# EAGLE design VFD PSU (EAGLE 9.1.3)
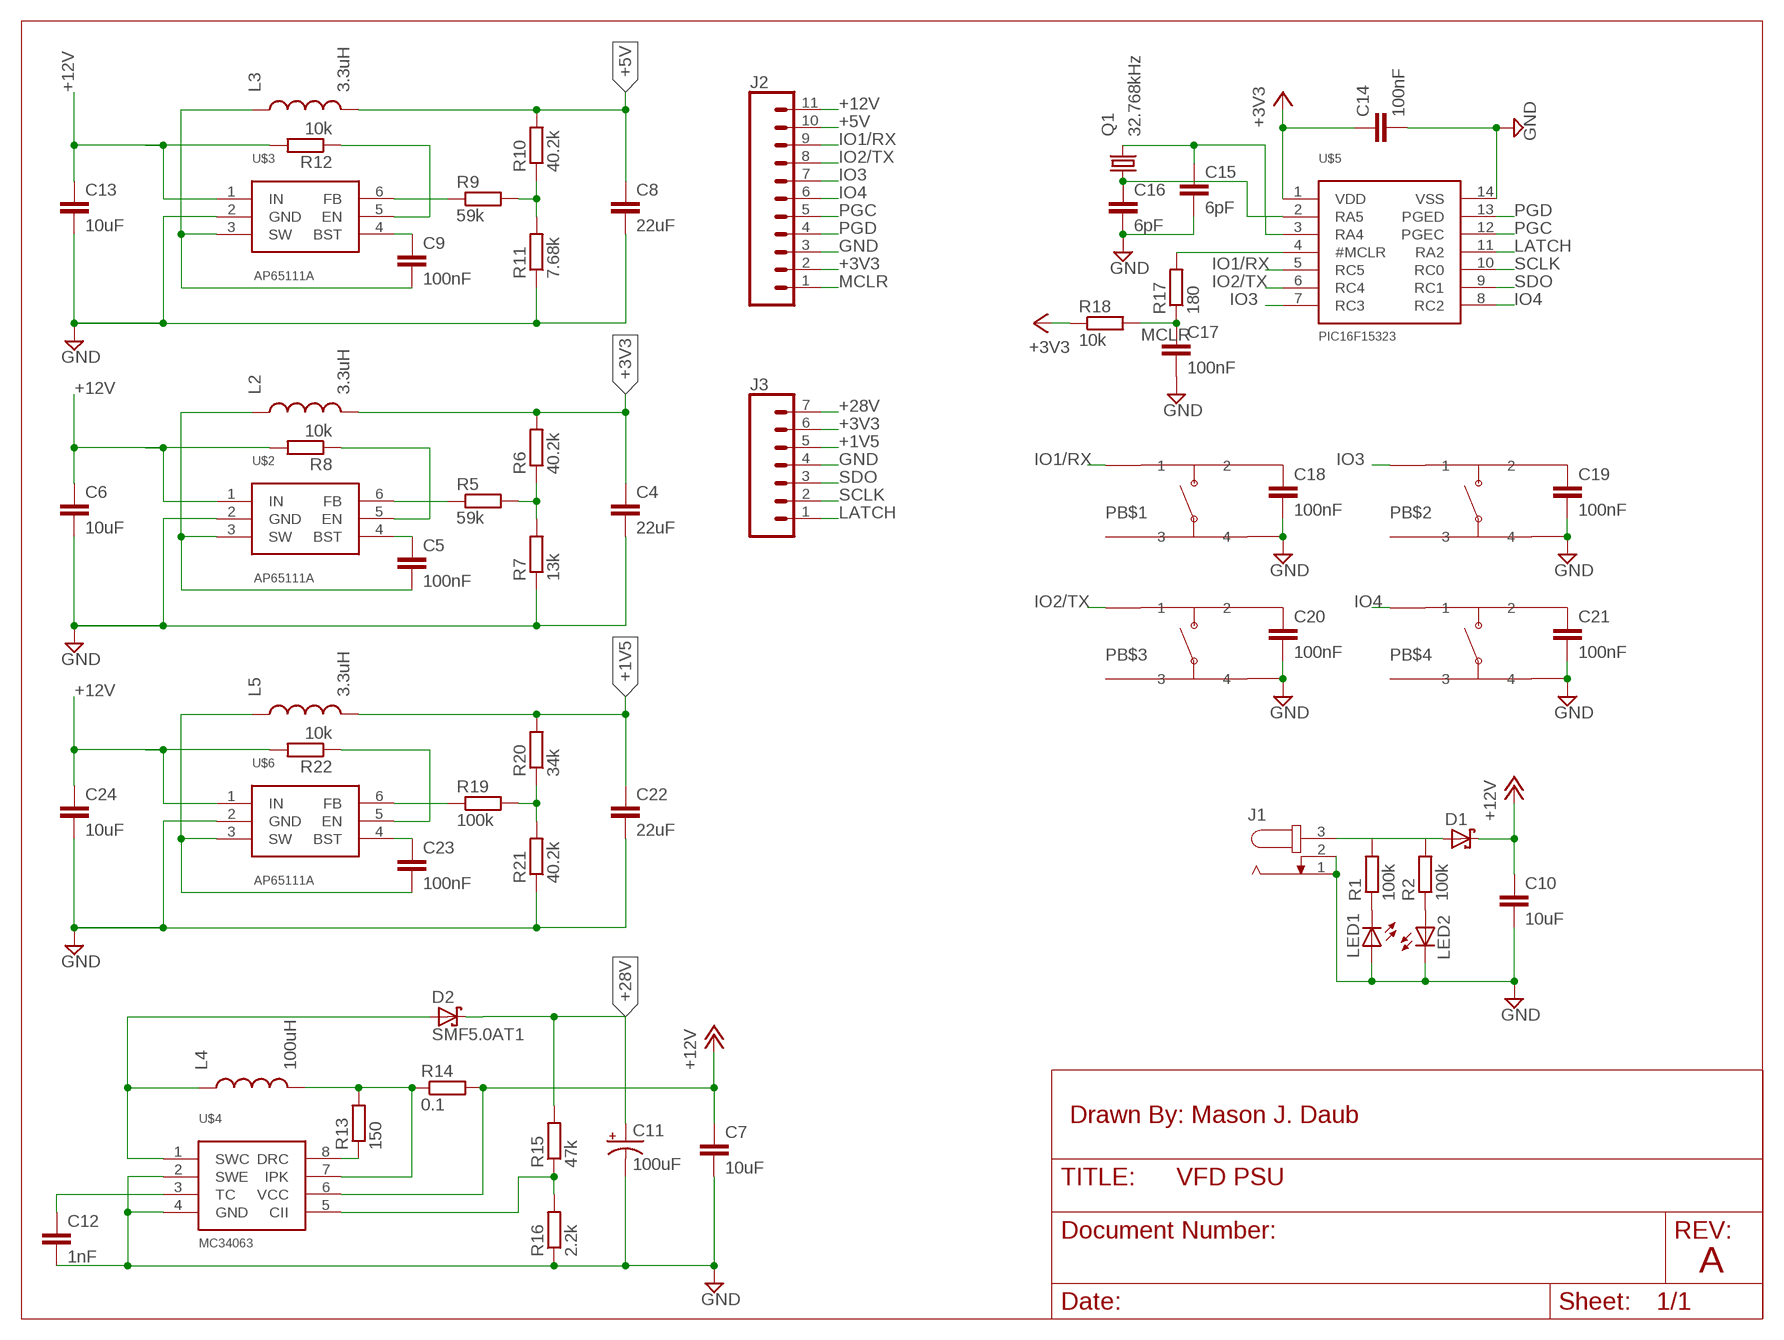
[diagram p0: schematic, sheet 1]

## Parts
C4  22uF  C-EUC0805  [C0805]
C5  100nF  C-EUC0603  [C0603]
C6  10uF  C-EUC0805  [C0805]
C7  10uF  C-EUC0805  [C0805]
C8  22uF  C-EUC0805  [C0805]
C9  100nF  C-EUC0603  [C0603]
C10  10uF  C-EUC0805  [C0805]
C11  100uF  22UF-POLAR-PANASONIC_C-35V-20%  [PANASONIC_C]
C12  1nF  C-EUC0603  [C0603]
C13  10uF  C-EUC0805  [C0805]
C14  100nF  C-EUC0603  [C0603]
C15  6pF  C-EUC0603  [C0603]
C16  6pF  C-EUC0603  [C0603]
C17  100nF  C-EUC0603  [C0603]
C18  100nF  C-EUC0603  [C0603]
C19  100nF  C-EUC0603  [C0603]
C20  100nF  C-EUC0603  [C0603]
C21  100nF  C-EUC0603  [C0603]
C22  22uF  C-EUC0805  [C0805]
C23  100nF  C-EUC0603  [C0603]
C24  10uF  C-EUC0805  [C0805]
D1  SCHOTTKY-DIODESMD  [SMB]
D2  SMF5.0AT1  [SOD123FL]
J1  JACK-PLUG0  [SPC4077]
J2  CONN_111X11_NO_SILK  [1X11_NO_SILK]
J3  CONN_07LONGPADS  [1X07_LONGPADS]
L2  3.3uH  L1008  [1008]
L3  3.3uH  L1008  [1008]
L4  100uH  ETQ-P5M101YGK  [2-SMD]
L5  3.3uH  L1008  [1008]
LED1  LEDSMT1206  [1206]
LED2  LEDSMT1206  [1206]
PB$1  PTS645SM43SMTR92-LFS  [SMDTACTILE]
PB$2  PTS645SM43SMTR92-LFS  [SMDTACTILE]
PB$3  PTS645SM43SMTR92-LFS  [SMDTACTILE]
PB$4  PTS645SM43SMTR92-LFS  [SMDTACTILE]
Q1  32.768kHz  KX-327-S  [8.2X3.8]
R1  100k  R-EU_R0603  [R0603]
R2  100k  R-EU_R0603  [R0603]
R5  59k  R-EU_R0603  [R0603]
R6  40.2k  R-EU_R0603  [R0603]
R7  13k  R-EU_R0603  [R0603]
R8  10k  R-EU_R0603  [R0603]
R9  59k  R-EU_R0603  [R0603]
R10  40.2k  R-EU_R0603  [R0603]
R11  7.68k  R-EU_R0603  [R0603]
R12  10k  R-EU_R0603  [R0603]
R13  150  R-EU_R0603  [R0603]
R14  0.1  R-EU_R0805  [R0805]
R15  47k  R-EU_R0603  [R0603]
R16  2.2k  R-EU_R0603  [R0603]
R17  180  R-EU_R0603  [R0603]
R18  10k  R-EU_R0603  [R0603]
R19  100k  R-EU_R0603  [R0603]
R20  34k  R-EU_R0603  [R0603]
R21  40.2k  R-EU_R0603  [R0603]
R22  10k  R-EU_R0603  [R0603]
U$2  AP65111A  [TSOT23-6]
U$3  AP65111A  [TSOT23-6]
U$4  MC34063  [SO08]
U$5  PIC16F15323  [SO14]
U$6  AP65111A  [TSOT23-6]

## Nets
+1V5: C22.1 J3.5 L5.P$2 R20.2
+3V3: C4.1 C14.1 J2.2 J3.6 L2.P$2 R6.2 R18.1 U$5.1(VDD)
+5V: C8.1 J2.10 L3.P$2 R10.2
+12V: C6.1 C7.1 C10.1 C13.1 C24.1 D1.C J2.11 R8.2 R12.2 R14.2 R22.2 U$2.1(IN) U$3.1(IN) U$4.6(VCC) U$6.1(IN)
+28V: C11.+ D2.C J3.7 R15.2
GND: C4.2 C6.2 C7.2 C8.2 C10.2 C11.- C12.2 C13.2 C14.2 C15.2 C16.2 C17.2 C18.2 C19.2 C20.2 C21.2 C22.2 C24.2 J1.1 J1.2 J2.3 J3.4 LED1.A LED2.C PB$1.P$4 PB$2.P$4 PB$3.P$4 PB$4.P$4 R7.1 R11.1 R16.1 R21.1 U$2.2(GND) U$3.2(GND) U$4.2(SWE) U$4.4(GND) U$5.14(VSS) U$6.2(GND)
IO1/RX: J2.9 PB$1.P$1 U$5.5(RC5)
IO2/TX: J2.8 PB$3.P$1 U$5.6(RC4)
IO3: J2.7 PB$2.P$1 U$5.7(RC3)
IO4: J2.6 PB$4.P$1 U$5.8(RC2)
LATCH: J3.1 U$5.11(RA2)
MCLR: C17.1 J2.1 R17.1 R18.2
N$1: R15.1 R16.2 U$4.5(CII)
N$2: D1.A J1.3 R1.2 R2.2
N$3: LED2.A R2.1
N$4: L4.P$2 R13.2 R14.1 U$4.7(IPK)
N$5: LED1.C R1.1
N$8: R8.1 U$2.5(EN)
N$9: C5.2 L2.P$1 U$2.3(SW)
N$10: C5.1 U$2.4(BST)
N$11: R5.1 U$2.6(FB)
N$12: R5.2 R6.1 R7.2
N$13: R13.1 U$4.8(DRC)
N$14: R12.1 U$3.5(EN)
N$15: C9.2 L3.P$1 U$3.3(SW)
N$16: C9.1 U$3.4(BST)
N$17: R9.1 U$3.6(FB)
N$18: R9.2 R10.1 R11.2
N$19: D2.A L4.P$1 U$4.1(SWC)
N$21: C15.1 Q1.4 U$5.3(RA4)
N$22: C16.1 Q1.1 U$5.2(RA5)
N$23: C12.1 U$4.3(TC)
N$24: R17.2 U$5.4(#MCLR)
N$25: C18.1 PB$1.P$2
N$26: R22.1 U$6.5(EN)
N$27: C19.1 PB$2.P$2
N$28: C23.2 L5.P$1 U$6.3(SW)
N$29: C20.1 PB$3.P$2
N$30: C23.1 U$6.4(BST)
N$31: C21.1 PB$4.P$2
N$32: R19.1 U$6.6(FB)
N$33: R19.2 R20.1 R21.2
PGC: J2.5 U$5.12(PGEC)
PGD: J2.4 U$5.13(PGED)
SCLK: J3.2 U$5.10(RC0)
SDO: J3.3 U$5.9(RC1)
Unconnected: PB$1.P$3 PB$2.P$3 PB$3.P$3 PB$4.P$3

## Notes on the sheet
- Drawn By: Mason J. Daub
- A

## Library data of the parts
C4-C10 C12-C24 = rcl:C-EU: CAPACITOR, European symbol; SPICEPREFIX: C
C11 = SparkFun-Capacitors:22UF-POLAR: 22µF polarized capacitors A capacitor is a passive two-terminal electrical component used to store electrical energy temporarily in an electric field.; PROD_ID: CAP-08618; VALUE: 22uF
D1 = diode:SCHOTTKY-DIODE: Schottky Diode
D2 = diode:SMF5.0AT1: 200 W Transient Voltage Suppressor Source: Data sheet <http://www.onsemi.com/pub_link/Collateral/SMF5.0AT1-D.PDF>
J1 = con-jack:JACK-PLUG: DC POWER JACK Power Jack, DC, Right Angle, Through Hole, Rated 5A at 16VDC, PC Terminals Distributor: Farnell (www.Farnell.de) Drawing: 84N1161.pdf / 84N1162.pdf Manufacturer: SPC Technology (www.spctechnology.com) Type: SPC4077 / SPC 4078; OC_FARNELL: unknown; OC_NEWARK: unknown
J2 = SparkFun-Connectors:CONN_11: Multi connection point. Often used as Generic Header-pin footprint for 0.1 inch spaced/style header connections On any of the 0.1 inch spaced packages, you can populate with these: Break Away Headers - Straight <https://www.sparkfun.com/products/116> (PRT-00116) Break Away Male Headers - Right Angle <https://www.sparkfun.com/products/553> (PRT-00553) Female Headers <https://www.sparkfun.com/products/115> (PRT-00115) Break Away Headers - Machine Pin <https://www.sparkfun.com/products/117> (PRT-00117) Break Away Female Headers - Swiss Machine Pin <https://www.sparkfun.com/products/743> (PRT-00743) For SCREWTERMINALS and SPRING TERMINALS visit here: Screw Terimnals on SparkFun.com <https://www.sparkfun.com/search/results?term=Screw+Terminals> (5mm/3.5mm/2.54mm spacing) This device is also useful as a general connection point to wire up your design to another part of your project. Our various solder wires solder well into these plated through hole pads. Hook-Up Wire - Assortment (Stranded, 22 AWG) <https://www.sparkfun.com/products/11375> (PRT-11375) Hook-Up Wire - Assortment (Solid Core, 22 AWG) <https://www.sparkfun.com/products/11367> (PRT-11367) View the entire wire category on our website here <https://www.sparkfun.com/categories/141>
J3 = SparkFun-Connectors:CONN_07: Multi connection point. Often used as Generic Header-pin footprint for 0.1 inch spaced/style header connections On any of the 0.1 inch spaced packages, you can populate with these: Break Away Headers - Straight <https://www.sparkfun.com/products/116> (PRT-00116) Break Away Male Headers - Right Angle <https://www.sparkfun.com/products/553> (PRT-00553) Female Headers <https://www.sparkfun.com/products/115> (PRT-00115) Break Away Headers - Machine Pin <https://www.sparkfun.com/products/117> (PRT-00117) Break Away Female Headers - Swiss Machine Pin <https://www.sparkfun.com/products/743> (PRT-00743) For SCREWTERMINALS and SPRING TERMINALS visit here: Screw Terimnals on SparkFun.com <https://www.sparkfun.com/search/results?term=Screw+Terminals> (5mm/3.5mm/2.54mm spacing) This device is also useful as a general connection point to wire up your design to another part of your project. Our various solder wires solder well into these plated through hole pads. Hook-Up Wire - Assortment (Stranded, 22 AWG) <https://www.sparkfun.com/products/11375> (PRT-11375) Hook-Up Wire - Assortment (Solid Core, 22 AWG) <https://www.sparkfun.com/products/11367> (PRT-11367) View the entire wire category on our website here <https://www.sparkfun.com/categories/141> Special notes: Molex polarized connector foot print use with SKU : PRT-08231 with associated crimp pins and housings. 1MM SMD Version SKU: PRT-10208 NOTES ON THE VARIANTS LOCK and LOCK_LONGPADS... This footprint was designed to help hold the alignment of a through-hole component (i.e. 6-pin header) while soldering it into place. You may notice that each hole has been shifted either up or down by 0.005 of an inch from it's more standard position (which is a perfectly straight line). This slight alteration caused the pins (the squares in the middle) to touch the edges of the holes. Because they are alternating, it causes a "brace" to hold the component in place. 0.005 has proven to be the perfect amount of "off-center" position when using our standard breakaway headers. Although looks a little odd when you look at the bare footprint, once you have a header in there, the alteration is very hard to notice. Also,if you push a header all the way into place, it is covered up entirely on the bottom side.
L2 L3 L5 = Mason-Passives:L1008
L4 = Mason-Passives:ETQ-P5M101YGK: 100uH j-lead surface mount inductor manufactured by panasonic
LED1 LED2 = led:LED: LED OSRAM: - CHIPLED LG R971, LG N971, LY N971, LG Q971, LY Q971, LO R971, LY R971 LH N974, LH R974 LS Q976, LO Q976, LY Q976 LO Q996 - Hyper CHIPLED LW Q18S LB Q993, LB Q99A, LB R99A - SideLED LS A670, LO A670, LY A670, LG A670, LP A670 LB A673, LV A673, LT A673, LW A673 LH A674 LY A675 LS A676, LA A676, LO A676, LY A676, LW A676 LS A679, LY A679, LG A679 - Hyper Micro SIDELED® LS Y876, LA Y876, LO Y876, LY Y876 LT Y87S - SmartLED LW L88C, LW L88S LB L89C, LB L89S, LG L890 LS L89K, LO L89K, LY L89K LS L896, LA L896, LO L896, LY L896 - TOPLED LS T670, LO T670, LY T670, LG T670, LP T670 LSG T670, LSP T670, LSY T670, LOP T670, LYG T670 LG T671, LOG T671, LSG T671 LB T673, LV T673, LT T673, LW T673 LH T674 LS T676, LA T676, LO T676, LY T676, LB T676, LH T676, LSB T676, LW T676 LB T67C, LV T67C, LT T67C, LS T67K, LO T67K, LY T67K, LW E67C LS E67B, LA E67B, LO E67B, LY E67B, LB E67C, LV E67C, LT E67C LW T67C LS T679, LY T679, LG T679 LS T770, LO T770, LY T770, LG T770, LP T770 LB T773, LV T773, LT T773, LW T773 LH T774 LS E675, LA E675, LY E675, LS T675 LS T776, LA T776, LO T776, LY T776, LB T776 LHGB T686 LT T68C, LB T68C - Hyper Mini TOPLED® LB M676 - Mini TOPLED Santana® LG M470 LS M47K, LO M47K, LY M47K Source: http://www.osram.convergy.de LUXEON: - LUMILED® LXK2-PW12-R00, LXK2-PW12-S00, LXK2-PW14-U00, LXK2-PW14-V00 LXK2-PM12-R00, LXK2-PM12-S00, LXK2-PM14-U00 LXK2-PE12-Q00, LXK2-PE12-R00, LXK2-PE12-S00, LXK2-PE14-T00, LXK2-PE14-U00 LXK2-PB12-K00, LXK2-PB12-L00, LXK2-PB12-M00, LXK2-PB14-N00, LXK2-PB14-P00, LXK2-PB14-Q00 LXK2-PR12-L00, LXK2-PR12-M00, LXK2-PR14-Q00, LXK2-PR14-R00 LXK2-PD12-Q00, LXK2-PD12-R00, LXK2-PD12-S00 LXK2-PH12-R00, LXK2-PH12-S00 LXK2-PL12-P00, LXK2-PL12-Q00, LXK2-PL12-R00 Source: www.luxeon.com KINGBRIGHT: KA-3528ASYC Source: www.kingbright.com
PB$1-PB$4 = Mason-Misc:PTS645SM43SMTR92-LFS: Standard tactile switch
Q1 = crystal-geyer_V1_0:KX-327: Tuning Fork Crystals (kHz) SMD: KX327 - Serie Model Size l/w/h [mm] Frequency Range Frequency Stability Temp. Range [°C] Load Capacitance AECQ 200 availabel Datasheet KX-327VT KX-327FT KX-327RT KX-327NHT KX-327NHF KX-327L KX-327S 1.25/1.05/0.5 1.6/1.0/0.5 2.0/1.2/0.6 3.2/1.5/0.8 3.2/1.5/0.8 7.0/1.5/1.4 8.2/3.8/2.5 32,768 kHz 32,768 kHz 32,768 kHz 32,768 kHz 32,768 kHz 32,768 kHz 32,768 kHz ±10 … ±20ppm ±10 … ±20ppm ±10 … ±20ppm ±10 … ±20ppm ±10 … ±20ppm ±10 … ±20ppm ±5 … ±20ppm (*) -40°C …+85°C (*) -40°C …+85°C (*) -40°C …+85°C (*) -40°C …+85°C (*) -40°C …+125°C (*) -40°C …+85°C (*) -40°C …+85°C 7/9/12,5 7/9/12,5 7/9/12,6 7/9/12,5 9/12,5 7/9/12,5 6/12,5 - - - - yes - - KX-327VT.pdf <http://www.geyer-electronic.de/uploads/tx_userartikelfrequenz/GEYER-KX-327VT.pdf> KX-327FT.pdf <http://www.geyer-electronic.de/uploads/tx_userartikelfrequenz/GEYER-KX-327FT.pdf> KX-327RT.pdf <http://www.geyer-electronic.de/uploads/tx_userartikelfrequenz/GEYER-KX-327RT.pdf> KX-327NHT.pdf <http://www.geyer-electronic.de/uploads/tx_userartikelfrequenz/GEYER-KX-327NHT.pdf> KX-327NHF.pdf <http://www.geyer-electronic.de/uploads/tx_userartikelfrequenz/GEYER-KX-327NHF.pdf> KX-327L.pdf <http://www.geyer-electronic.de/uploads/tx_userartikelfrequenz/GEYER-KX-327L.pdf> KX-327S.pdf <http://www.geyer-electronic.de/uploads/tx_userartikelfrequenz/GEYER-KX-327S.pdf> <http://www.geyer-electronic.de/fileadmin/template/img/logo-geyer-electronic.png> Details see: http://www.geyer-electronic.de/Frequenz-Produkte.9.0.html Created 2016-06-07, Hans Locher 2016 (C) Geyer Quartz Technology KX327VT,KX327FT,KX327RT,KX327NHT,KX327NHF,KX327S,KX327L;125105;1610;2012;3215;7015;8238;1,25x1,05,1.25x1.05;1,6x1,0,1.6x1.0;2,0x1,2,2.0x1.2;3,2x1,5,3.2x1.5;8,2x3,8,8.2x3.8,7.0x1.5,7,0x1,532.768kHz
R1 R2 R5-R13 R15-R22 = resistor:R-EU_: RESISTOR, European symbol
R14 = rcl:R-EU_: RESISTOR, European symbol; SPICEPREFIX: R
U$2 U$3 U$6 = Mason-Power:AP65111A: 18v 1.5A max buck converter manufactured by Diodes Incorporated
U$4 = Mason-Power:MC34063
U$5 = Mason-MCUs:PIC16F15323: A 14 pin 8 bit pic microcontroller manufactured by microchip

## Board
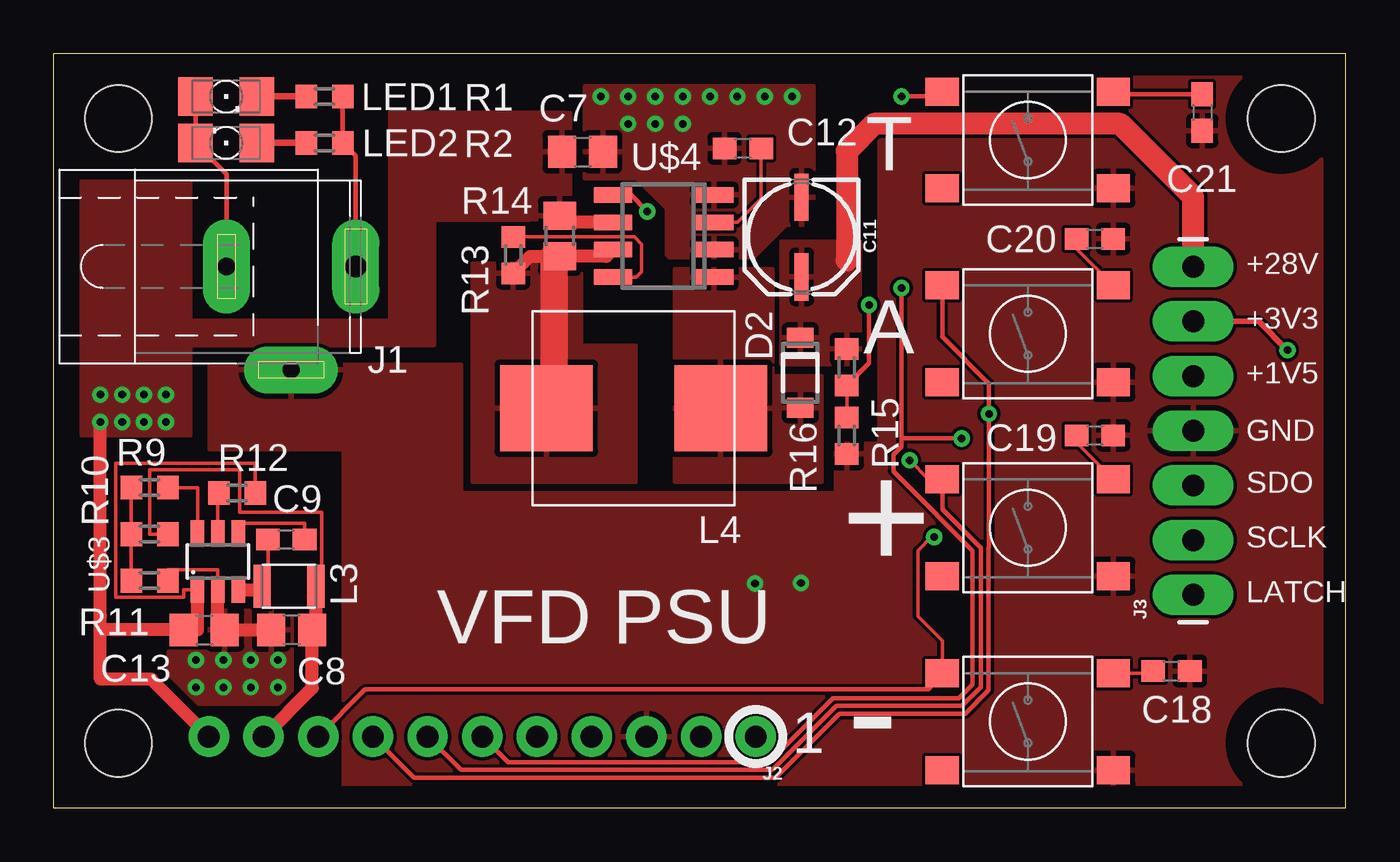
[diagram p1: board, top side]
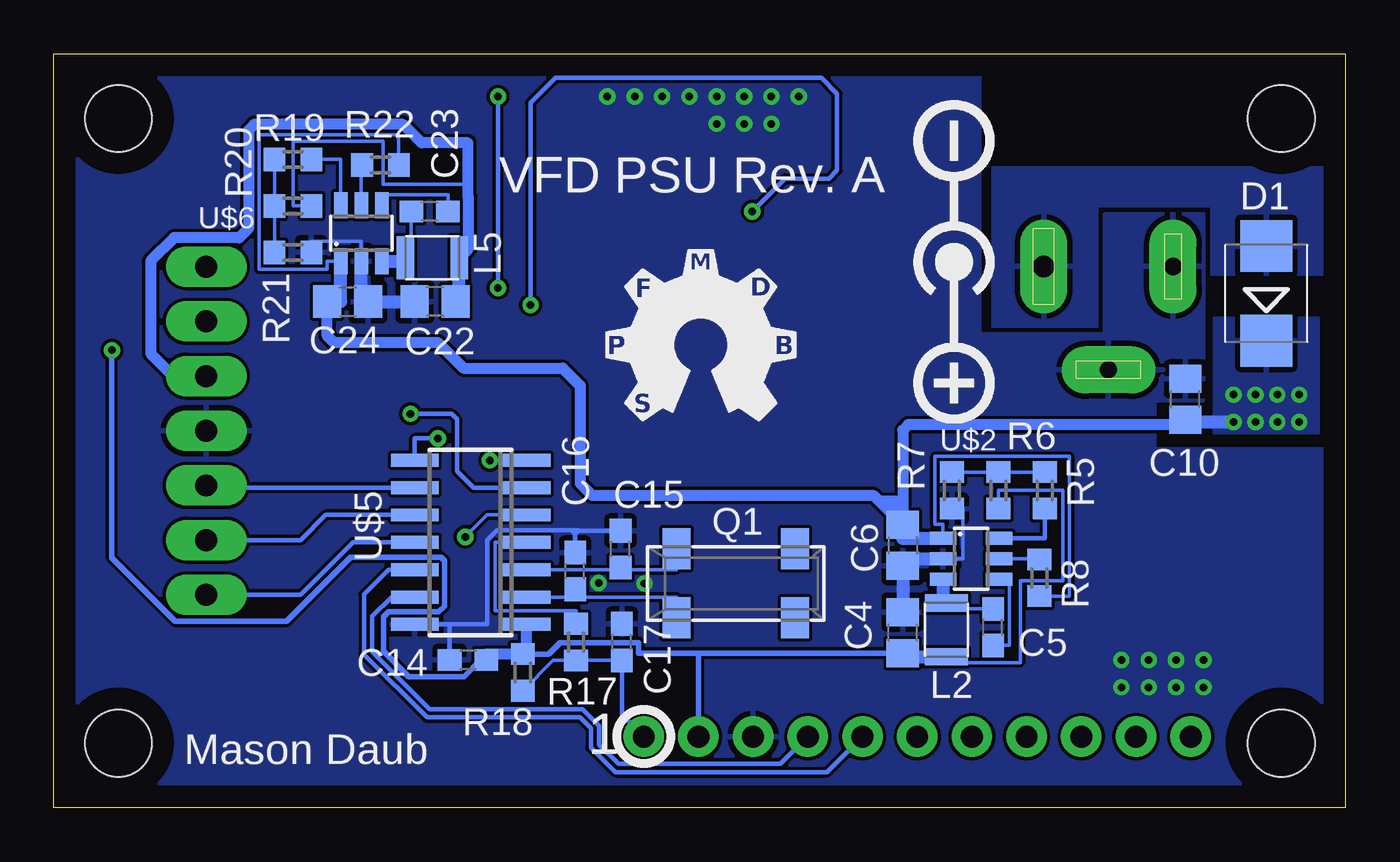
[diagram p2: board, bottom side, seen from below]

Size 60 x 35 mm. Coordinates in mm from the lower left corner, seen from the top.
Outline: 60,0 60,35 0,35 0,0 60,0
Copper layers (1*16): Top 0.035mm / dielectric 1.5mm / Bottom 0.035mm
Design rules "default": minimum track width 6mil, minimum drill 0.35mm, track to track 6mil, track to pad 6mil, pad to pad 6mil, via to via 6mil, smd to smd 6mil, copper to edge 40mil, drill to drill 6mil, minimum pad ring 10mil, minimum via ring 8mil, stop-mask expansion 4mil, vias tented up to drill 0mil, thermal gap 10mil
Holes 3.1 mm at 3,32 57,32 57,3 3,3

### Footprints (pad centres in the part's own frame; a part is rotated, then mirrored left to right if it is on the bottom)
C0805 = smd 1.3 x 1.5: 1 -0.95,0; 2 0.95,0
C0603 = smd 1.1 x 1: 1 -0.85,0; 2 0.85,0
PANASONIC_C = smd 2.2 x 0.65: + 1.9,-0.2; - -1.8,-0.2
SMB = smd 2.4 x 2.4: A 2.2,0; C -2.2,0
SOD123FL = smd 0.91 x 1.22: A 1.625,0; C -1.625,0
SPC4077 = drill 0.8 pad 2.184 long: 1 -3,0; 2 0,-4.8 | drill 1 pad 2.184 long: 3 3,0
1X11_NO_SILK = drill 1.016 pad 1.88: 1 0,0; 2 2.54,0; 3 5.08,0; 4 7.62,0; 5 10.16,0; 6 12.7,0; 7 15.24,0; 8 17.78,0; 9 20.32,0; 10 22.86,0; 11 25.4,0
1X07_LONGPADS = drill 1.016 pad 1.88 long: 1 0,0; 2 2.54,0; 3 5.08,0; 4 7.62,0; 5 10.16,0; 6 12.7,0; 7 15.24,0
1008 = smd 0.8 x 2: P$1 -1.25,0; P$2 1.25,0
2-SMD = smd 4.3 x 4: P$1 -4.05,0; P$2 4.05,0
1206 = smd 1.6 x 1.803: A -1.422,0; C 1.422,0
SMDTACTILE = smd 1.55 x 1.3: P$1 -3.975,2.25; P$2 3.975,2.25; P$3 -3.975,-2.25; P$4 3.975,-2.25
8.2X3.8 = smd 1.3 x 1.9: 1 -2.75,-1.6; 2 2.75,-1.6; 3 2.75,1.6; 4 -2.75,1.6
R0603 = smd 1 x 1.1: 1 -0.85,0; 2 0.85,0
R0805 = smd 1.3 x 1.5: 1 -0.95,0; 2 0.95,0
TSOT23-6 = smd 0.62 x 1.22: 1 -0.95,-1.3; 2 0,-1.3; 3 0.95,-1.3; 4 0.95,1.3; 5 0,1.3; 6 -0.95,1.3
SO08 = smd 0.72 x 1.78: 1 -1.905,-2.35; 2 -0.635,-2.35; 3 0.635,-2.35; 4 1.905,-2.35; 5 1.905,2.35; 6 0.635,2.35; 7 -0.635,2.35; 8 -1.905,2.35
SO14 = smd 0.6 x 2.2: 1 -3.81,-2.6; 2 -2.54,-2.6; 3 -1.27,-2.6; 4 0,-2.6; 5 1.27,-2.6; 6 2.54,-2.6; 7 3.81,-2.6; 8 3.81,2.6; 9 2.54,2.6; 10 1.27,2.6; 11 0,2.6; 12 -1.27,2.6; 13 -2.54,2.6; 14 -3.81,2.6

### Placement (x,y rotation side)
C4  20.57,8.13 90 bottom
C5  16.38,8.38 90 bottom
C6  20.57,12.19 270 bottom
C7  24.55,30.45 0 top
C8  11.05,8.26 180 top
C9  10.79,12.45 180 top
C10  7.45,18.96 90 bottom
C11  34.92,26.54 270 top
C12  32,30.61 180 top
C13  6.99,8.26 0 top
C14  40.77,6.86 180 bottom
C15  33.68,12.01 90 bottom
C16  35.79,10.99 90 bottom
C17  33.62,7.69 90 bottom
C18  51.91,6.35 0 top
C19  48.35,17.29 0 top
C20  48.35,26.41 0 top
C21  53.34,32.28 270 top
C22  42.29,23.5 180 bottom
C23  42.55,27.69 180 bottom
C24  46.35,23.5 0 bottom
D1  3.68,23.88 90 bottom
D2  34.67,20.19 270 top
J1  11.02,25.13 0 top
J2  32.6,3.3 180 top
J3  52.92,9.88 90 top
L2  18.54,8.26 270 bottom
L3  10.92,10.29 0 top
L4  26.92,18.54 180 top
L5  42.42,25.53 0 bottom
LED1  8,33.02 0 top
LED2  8,30.86 180 top
PB$1  45.23,4 0 top
PB$2  45.23,13 0 top
PB$3  45.23,22 0 top
PB$4  45.23,31 0 top
Q1  28.32,10.41 0 bottom
R1  12.57,33.02 0 top
R2  12.57,30.86 0 top
R5  13.97,14.73 90 bottom
R6  16.13,14.73 270 bottom
R7  18.29,14.73 90 bottom
R8  14.22,10.67 270 bottom
R9  4.45,14.86 180 top
R10  4.45,12.7 0 top
R11  4.45,10.54 180 top
R12  8.51,14.61 0 top
R13  21.34,25.65 270 top
R14  23.5,26.54 90 top
R15  36.83,20.45 90 top
R16  36.83,17.27 90 top
R17  35.74,7.69 90 bottom
R18  38.22,6.28 270 bottom
R19  48.9,30.1 180 bottom
R20  48.9,27.94 0 bottom
R21  48.9,25.78 180 bottom
R22  44.83,29.84 0 bottom
U$2  17.4,11.56 270 bottom
U$3  7.62,11.43 0 top
U$4  28.32,26.54 90 top
U$5  40.64,12.32 90 bottom
U$6  45.72,26.67 0 bottom

### Tracks (layer width: path | path; a pad name or v marks a point on that pad's centre or on a via)
+1V5
  Bottom 0.152: R20.2 48.26,27.94 | 48.26,27.94 48.9,27.94 | 48.26,27.94 48.9,27.94 | 48.9,27.94 48.9,30.94 44.7,30.94 44.7,30.62 44.71,30.62 44.71,29.07 44.7,29.07 44.7,28.96 40.89,28.96 40.89,26.04 41.17,26.04 L5.P$2
  Bottom 0.508: L5.P$2 40.74,25.96 40.74,28.35 40.77,28.38 40.77,30.86 42.92,30.86 43.78,31.73 50.7,31.73 50.7,31.7 50.96,31.44 50.96,26.89 51.4,26.45 51.42,26.47 54.42,26.47 55.5,25.39 55.5,21.08 54.46,20.04 J3.5
  Bottom 0.61: C22.1 41.17,23.5 L5.P$2
+3V3  (via drill 0.35)
  Top 0.254: J3.6 55.96,22.58 v57.3,21.24
  Bottom 0.152: L2.P$2 18.03,7 18.03,6.73 15.11,6.73 15.11,10.54 15,10.54 15,10.55 13.45,10.55 13.45,10.54 13.13,10.54 13.13,14.73 16.13,14.73 R6.2 | 39.92,7.13 C14.1 | R18.1 38.04,7.13
  Bottom 0.254: R18.1 37.02,7.13 36.48,7.67 33.02,7.67 32.84,7.67 32.84,7.18 30.48,7.18 | C4.1 27.94,7.18 30.48,7.18 | J2.2 30.06,7.18 30.48,7.18 | C14.1 40.17,6.86 40.95,6.08 43.51,6.08 44.69,7.25 44.69,8.86 44.46,9.09 42.13,9.09 41.86,9.36 41.86,11.47 42.02,11.63 46.21,11.63 49.18,8.66 54.37,8.66 57.3,11.6 v57.3,21.24
  Bottom 0.508: R18.1 39.92,7.13 | 38.04,7.13 U$5.1
  Bottom 0.61: C4.1 20.57,7 L2.P$2
+5V
  Top 0.152: L3.P$2 12.17,10.79 12.45,10.79 12.45,13.72 8.64,13.72 8.64,13.83 8.64,13.96 8.63,13.96 8.63,15.25 8.64,15.26 8.64,15.7 4.45,15.7 4.45,12.7 R10.2
  Top 0.61: L3.P$2 12.17,8.26 C8.1 12,5.56 J2.10
+12V  (via drill 0.35)
  Top 0.152: R12.2 9.36,16 2.87,16 2.87,9.76 6.02,9.76 6.02,10.13 U$3.1
  Top 0.61: U$3.1 6.67,8.26 C13.1 2.16,8.26 2.16,8.89 | U$4.6 23.81,27.18 R14.2 | 2.16,8.89 v2.16,17.91 | 2.16,8.89 2.16,5.97 4.53,5.97 J2.11
  Bottom 0.152: R22.2 43.98,31.24 50.47,31.24 50.47,25 47.32,25 47.32,25.37 U$6.1 | 13.97,9.82 13.81,9.82 12.83,9.82 12.83,16.31 19.07,16.31 19.07,13.15 18.7,13.15 U$2.1
  Bottom 0.254: R8.2 | R8.2 13.81,9.82
  Bottom 0.508: C10.1 7.68,17.78 20.32,17.78 20.57,17.53 20.57,15.3 | 20.57,15.3 20.57,14.22 | 20.57,14.22 C6.1 21.18,13.74 | C24.1 47.3,21.91 46.99,21.59 42.16,21.59 40.98,20.41 36.36,20.41 35.55,19.59 35.55,15.06 34.99,14.51 21.94,14.51 | 21.18,13.74 21.94,14.51 | 20.57,15.3 20.57,14.35 21.18,13.74 | 20.57,14.22 21.65,14.22 21.94,14.51
  Bottom 0.61: C24.1 46.67,23.5 U$6.1 | C6.1 20.57,12.51 U$2.1 | v5.21,17.91 7.45,17.91 C10.1
  other vias: 2.16,19.18 3.17,19.18 4.19,19.18 5.21,19.18 3.17,17.91 4.19,17.91
  pour Top: 24,28.45 24,32.26 19.56,32.26 19.56,27.3 22.61,27.3
  pour Top: 1.27,29.08 1.27,17.27 6.35,17.27 6.35,29.08
  pour Bottom: 1.65,17.4 6.1,17.4 6.1,20.45 6.1,22.73 1.27,22.73 1.27,17.4
  pour Top: 23.75,32.26 15.62,32.26 15.62,22.61 5.59,22.61 5.59,21.46 17.65,21.46 17.65,27.3 22.1,27.3 22.1,28.96 23.75,28.96 23.75,32.13
+28V
  Top 1.016: J3.7 52.92,28.36 49.53,31.75 38.1,31.75 36.83,30.48 36.83,25.4
  pour Top: 33.78,21.08 33.78,26.29 35.81,26.29 37.47,26.29 37.47,23.5 37.47,20.57 33.78,20.57
GND  (via drill 0.35)
  Top 0.152: R11.1 5.29,11.05 7.62,11.05 7.62,9.78
  Top 0.203: LED1.A LED2.C 8.02,29.42 J1.1
  Top 0.61: U$3.2 7.62,9.78 7.62,8.26 C13.2 C8.2
  Bottom 0.152: R21.1 48.05,26.29 45.72,26.29 45.72,25.02 | R7.1 17.78,13.88 17.78,11.56 19.05,11.56 | C14.2 41.62,8.51 43.18,8.51 U$5.14
  Bottom 0.203: C15.2 35.63,12.86 35.67,12.82 | C16.2 35.79,12.7 | 35.79,12.7 35.67,12.82 | 35.79,12.7 35.97,12.87 | 35.97,12.87 39.41,12.87 39.88,12.41 39.88,8.51 41.66,8.51 | 41.66,8.51 43.18,8.51 | C14.2 41.62,8.47 41.66,8.51 | 35.97,12.87 35.62,12.87 35.67,12.82
  Bottom 0.61: U$6.2 45.72,25.02 45.72,23.5 C24.2 C22.2 | U$2.2 19.05,11.56 20.57,11.56 C6.2 C4.2
  other vias: 7.87,6.86 9.14,6.86 10.41,6.86 7.87,5.59 9.14,5.59 10.41,5.59 6.6,6.86 6.6,5.59 25.4,33.02 26.67,33.02 27.94,33.02 29.21,33.02 30.48,33.02 31.75,33.02 33.02,33.02 34.29,33.02 26.67,31.75 27.94,31.75 29.21,31.75 34.7,10.43 32.57,10.41
  pour Top: 35.31,27.05 34.04,27.05 32.51,25.53 28.57,25.53 28.45,25.65 28.45,27.81 27.05,29.21 24.64,29.21 24.64,33.53 35.31,33.53
  pour Bottom: 6.6,27.56 6.6,18.92 8.89,18.92 8.89,18.8 16.38,18.8 16.38,21.97 11.18,21.97 11.18,27.56
  pour Top: 7.24,20.57 18.92,20.57 18.92,14.61 36.32,14.61 36.32,16.89 38.35,16.89 38.35,34.67 59.69,34.67 59.69,0.38 13.46,0.38 13.46,14.99 13.46,16.64 7.24,16.64
  pour Bottom: 16.13,21.97 17.02,21.97 17.02,25.15 17.02,34.67 55.75,34.67 59.69,34.67 59.69,28.57 59.69,0.38 -0.25,0.38 -0.25,16.64 8.89,16.64 8.89,19.05 16.51,19.05 16.51,21.08 16.13,21.08
  pour Top: 7.24,9.14 11.05,9.14 11.05,6.35 11.05,5.46 10.41,4.83 6.73,4.83 5.33,6.22 5.33,7.24 7.24,7.24
IO1/RX  (via drill 0.35)
  Top 0.152: PB$1.P$1 41.26,7.76 41.02,8 40.13,8.89 40.13,11.94 40.77,12.57 v40.89,12.57
  Top 0.203: J2.9 14.47,5.49 40.62,5.49 PB$1.P$1
  Bottom 0.152: v40.89,12.57 39.88,13.59 U$5.5
IO2/TX  (via drill 0.35)
  Top 0.203: J2.8 16.73,1.4 33.52,1.4 36.49,4.37 37.13,4.37 42.33,4.37 43.41,5.45 43.41,12.04 43.43,12.06 v43.43,18.29 43.43,19.68 41.26,21.86 PB$3.P$1
  Bottom 0.203: U$5.6 40.51,14.86 41.27,15.62 41.27,18.03 41.53,18.29 v43.43,18.29
IO3  (via drill 0.35)
  Top 0.152: v39.75,16.13 40.63,15.25 PB$2.P$1
  Top 0.203: J2.7 18.91,1.75 33.37,1.75 36.34,4.72 42.18,4.72 43.05,5.59 43.05,12.06 41.26,13.85 PB$2.P$1
  Bottom 0.152: U$5.7 v39.75,16.13
IO4  (via drill 0.35)
  Top 0.203: J2.6 21.09,2.11 33.22,2.11 36.2,5.08 42.04,5.08 42.67,5.71 42.67,11.94 39.37,15.24 38.99,15.62 38.99,16.39 39.37,16.77 39.37,17.14 | PB$4.P$1 41.26,33.02 v39.37,33.02 | v39.37,24.13 39.37,17.14 | v42.16,17.14 39.37,17.14
  Bottom 0.203: v39.37,24.13 v39.37,33.02 | U$5.8 43.24,17.14 v42.16,17.14
LATCH
  Bottom 0.203: U$5.11 46.1,12.32 48.54,9.88 J3.1
MCLR
  Bottom 0.152: C17.1 R17.1 36.81,6.84 R18.2
  Bottom 0.203: J2.1 33.62,4.32 C17.1
N$1  (via drill 0.35)
  Top 0.152: 25.78,28.45 U$4.5 | R15.1 36.83,19.43 R16.2
  Top 0.203: v27.56,27.69 26.8,28.45 25.78,28.45 | v37.86,23.34 37.86,20.63 R15.1
  Bottom 0.203: v27.56,27.69 26.04,29.21 24,29.21 23.62,29.59 23.62,33.15 24.36,33.88 36.7,33.88 37.86,32.72 v37.86,23.34
N$2
  Top 0.203: R1.2 R2.2 14.02,30.26 J1.3
  pour Bottom: 1.02,29.72 1.02,24.77 6.22,24.77 6.22,27.94 11.56,27.94 11.56,22.35 16.38,22.35 16.38,29.72
N$3
  Top 0.305: LED2.A R2.1
N$4
  Top 0.61: R13.2 22.12,25.59 23.24,25.59 | 23.24,25.59 R14.1 | U$4.7 25.66,25.59 23.24,25.59
  Top 1.27: L4.P$2 23.24,18.91 23.24,25.59
  pour Top: 24.51,25.27 24.51,21.46 27.05,21.46 27.05,15.11 19.43,15.11 19.43,25.27
N$5
  Top 0.305: LED1.C R1.1
N$8
  Bottom 0.152: U$2.5 14.22,11.56 R8.1
N$9
  Bottom 0.152: L2.P$1 18.54,9.23 C5.2
  Bottom 0.61: U$2.3 18.7,9.51 L2.P$1
N$10
  Bottom 0.152: C5.1 15.62,7.53 15.62,10.67 16.1,10.67 U$2.4
N$11
  Bottom 0.203: R5.1 13.97,12.51 U$2.6
N$12
  Bottom 0.152: R7.2 R6.1 R5.2
N$13
  Top 0.152: R13.1 26.96,26.5 27.3,26.16 27.3,24.89 27.05,24.64 U$4.8
N$14
  Top 0.152: U$3.5 7.62,14.61 R12.1
N$15
  Top 0.152: L3.P$1 9.95,10.29 C9.2
  Top 0.61: U$3.3 9.67,10.13 L3.P$1
N$16
  Top 0.152: C9.1 11.64,13.21 8.51,13.21 8.51,12.73 U$3.4
N$17
  Top 0.152: R9.1 6.67,14.86 U$3.6
N$18
  Top 0.152: R11.2 R10.1 R9.2
N$19
  pour Top: 31.75,25.02 28.83,25.02 28.83,15.11 35.69,15.11 35.69,20.07 33.4,20.07 33.4,25.02
N$21
  Bottom 0.152: U$5.3 33.53,11.05 | 33.53,11.05 31.07,11.05 Q1.4 | C15.1 33.68,11.05 33.53,11.05
N$22
  Bottom 0.152: Q1.1 31.07,9.78 U$5.2 35.79,9.78 C16.1
N$23
  Top 0.152: C12.1 32.85,28.28 31.75,27.18 U$4.3
N$24
  Bottom 0.152: R17.2 35.74,9.14 39.5,9.14 39.5,12.32 U$5.4
N$25
  Top 0.152: PB$1.P$2 50.96,6.25 C18.1
N$26
  Bottom 0.152: U$6.5 45.72,29.84 R22.1
N$27
  Top 0.152: C19.1 47.5,16.96 PB$2.P$2
N$28
  Bottom 0.152: L5.P$1 43.4,25.53 C23.2
  Bottom 0.61: U$6.3 43.67,25.37 L5.P$1
N$29
  Top 0.152: C20.1 47.5,25.96 PB$3.P$2
N$30
  Bottom 0.152: C23.1 41.7,28.45 44.83,28.45 44.83,27.97 U$6.4
N$31
  Top 0.203: C21.1 49.33,33.13 PB$4.P$2
N$32
  Bottom 0.152: R19.1 46.67,30.1 U$6.6
N$33
  Bottom 0.152: R21.2 R20.1 R19.2
PGC
  Bottom 0.203: U$5.12 44.45,11.05 45.59,9.91 45.59,7.11 42.67,4.19 35.56,4.19 35.05,3.68 35.05,2.79 33.91,1.65 24.09,1.65 J2.5
PGD
  Bottom 0.203: J2.4 26.25,2.03 33.78,2.03 34.67,2.92 34.67,3.81 35.43,4.57 42.55,4.57 45.21,7.24 45.21,8.89 44.32,9.78 U$5.13
SCLK
  Bottom 0.203: U$5.10 47.37,13.59 48.54,12.42 J3.2
SDO
  Bottom 0.152: 52.82,14.86 J3.3
  Bottom 0.203: U$5.9 52.82,14.86

### Text on the board
tPlace: T | +28V | +3V3 | A | +1V5 | GND | SDO | SCLK | + | LATCH | 1 | -
bPlace: VFD PSU Rev. A | L2 | 1 | Mason Daub
tNames: VFD PSU